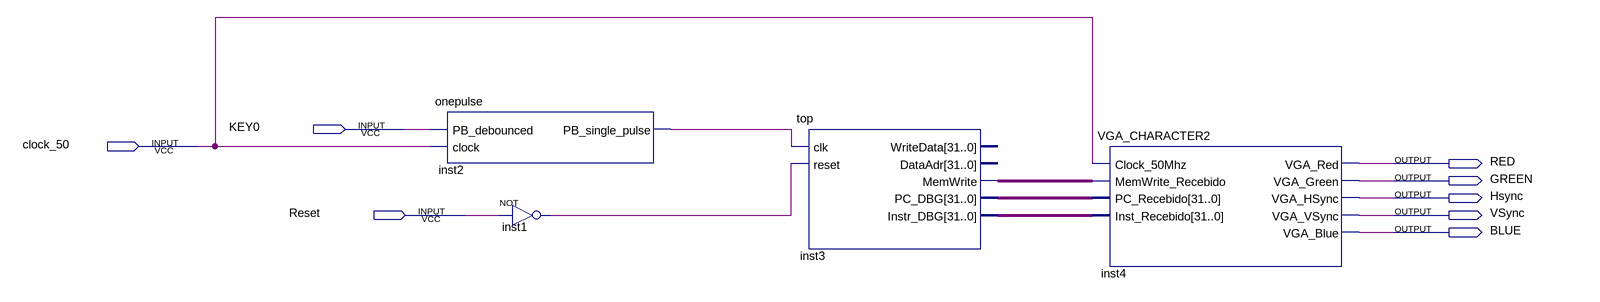
[diagram p0: schematic sheet]
// Quartus schematic block.bdf as structural Verilog: 4 symbols, 8 pins
module block (
  input  KEY0,
  input  clock_50,
  input  Reset,
  output RED,
  output GREEN,
  output Hsync,
  output VSync,
  output BLUE
);

  wire inst1_out, inst2_pb_single_pulse, inst3_memwrite;
  wire [31:0] inst3_instr_dbg, inst3_pc_dbg;

  onepulse inst2 (.PB_debounced(KEY0), .clock(clock_50), .PB_single_pulse(inst2_pb_single_pulse));
  not inst1 (inst1_out, Reset);
  top inst3 (
    .clk(inst2_pb_single_pulse), .reset(inst1_out), .MemWrite(inst3_memwrite), .PC_DBG(inst3_pc_dbg),
    .Instr_DBG(inst3_instr_dbg));  // open: WriteData, DataAdr
  VGA_CHARACTER2 inst4 (
    .Clock_50Mhz(clock_50), .MemWrite_Recebido(inst3_memwrite), .PC_Recebido(inst3_pc_dbg),
    .Inst_Recebido(inst3_instr_dbg), .VGA_Red(RED), .VGA_Green(GREEN), .VGA_HSync(Hsync), .VGA_VSync(VSync),
    .VGA_Blue(BLUE));
endmodule
